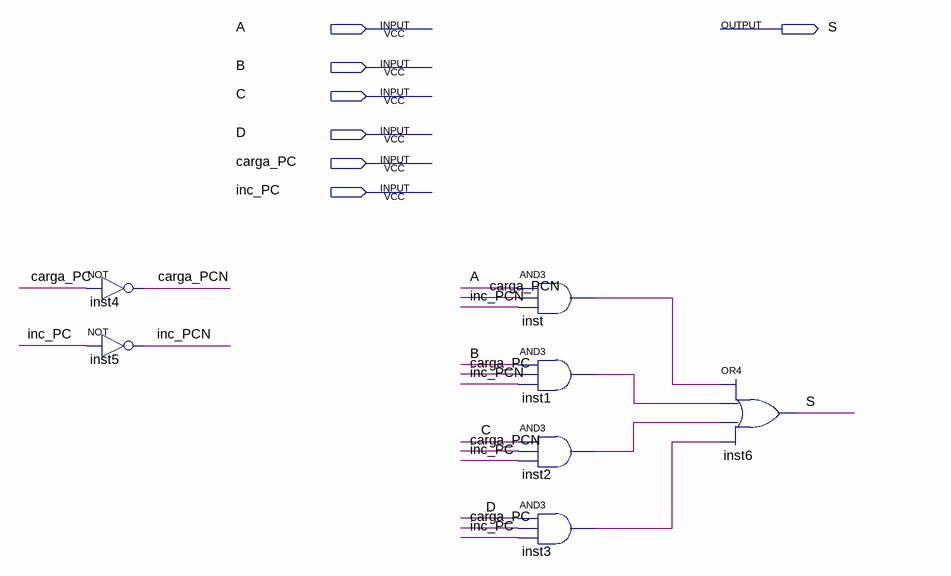
[diagram p0: schematic sheet]
// Quartus schematic MUX4_1_PC.bdf as structural Verilog: 7 symbols, 7 pins
module MUX4_1_PC (
  input  A,
  input  B,
  input  C,
  input  D,
  input  carga_PC,
  input  inc_PC,
  output S
);

  wire carga_PCN, inc_PCN, inst1_out, inst2_out, inst3_out, inst_out;

  not inst4 (carga_PCN, carga_PC);
  not inst5 (inc_PCN, inc_PC);
  and inst (inst_out, A, carga_PCN, inc_PCN);
  and inst1 (inst1_out, B, carga_PC, inc_PCN);
  and inst2 (inst2_out, C, carga_PCN, inc_PC);
  and inst3 (inst3_out, D, carga_PC, inc_PC);
  or inst6 (S, inst_out, inst1_out, inst2_out, inst3_out);
endmodule
